# Altium schematic sheet NIXIEClock_SCH.SchDoc
size A2
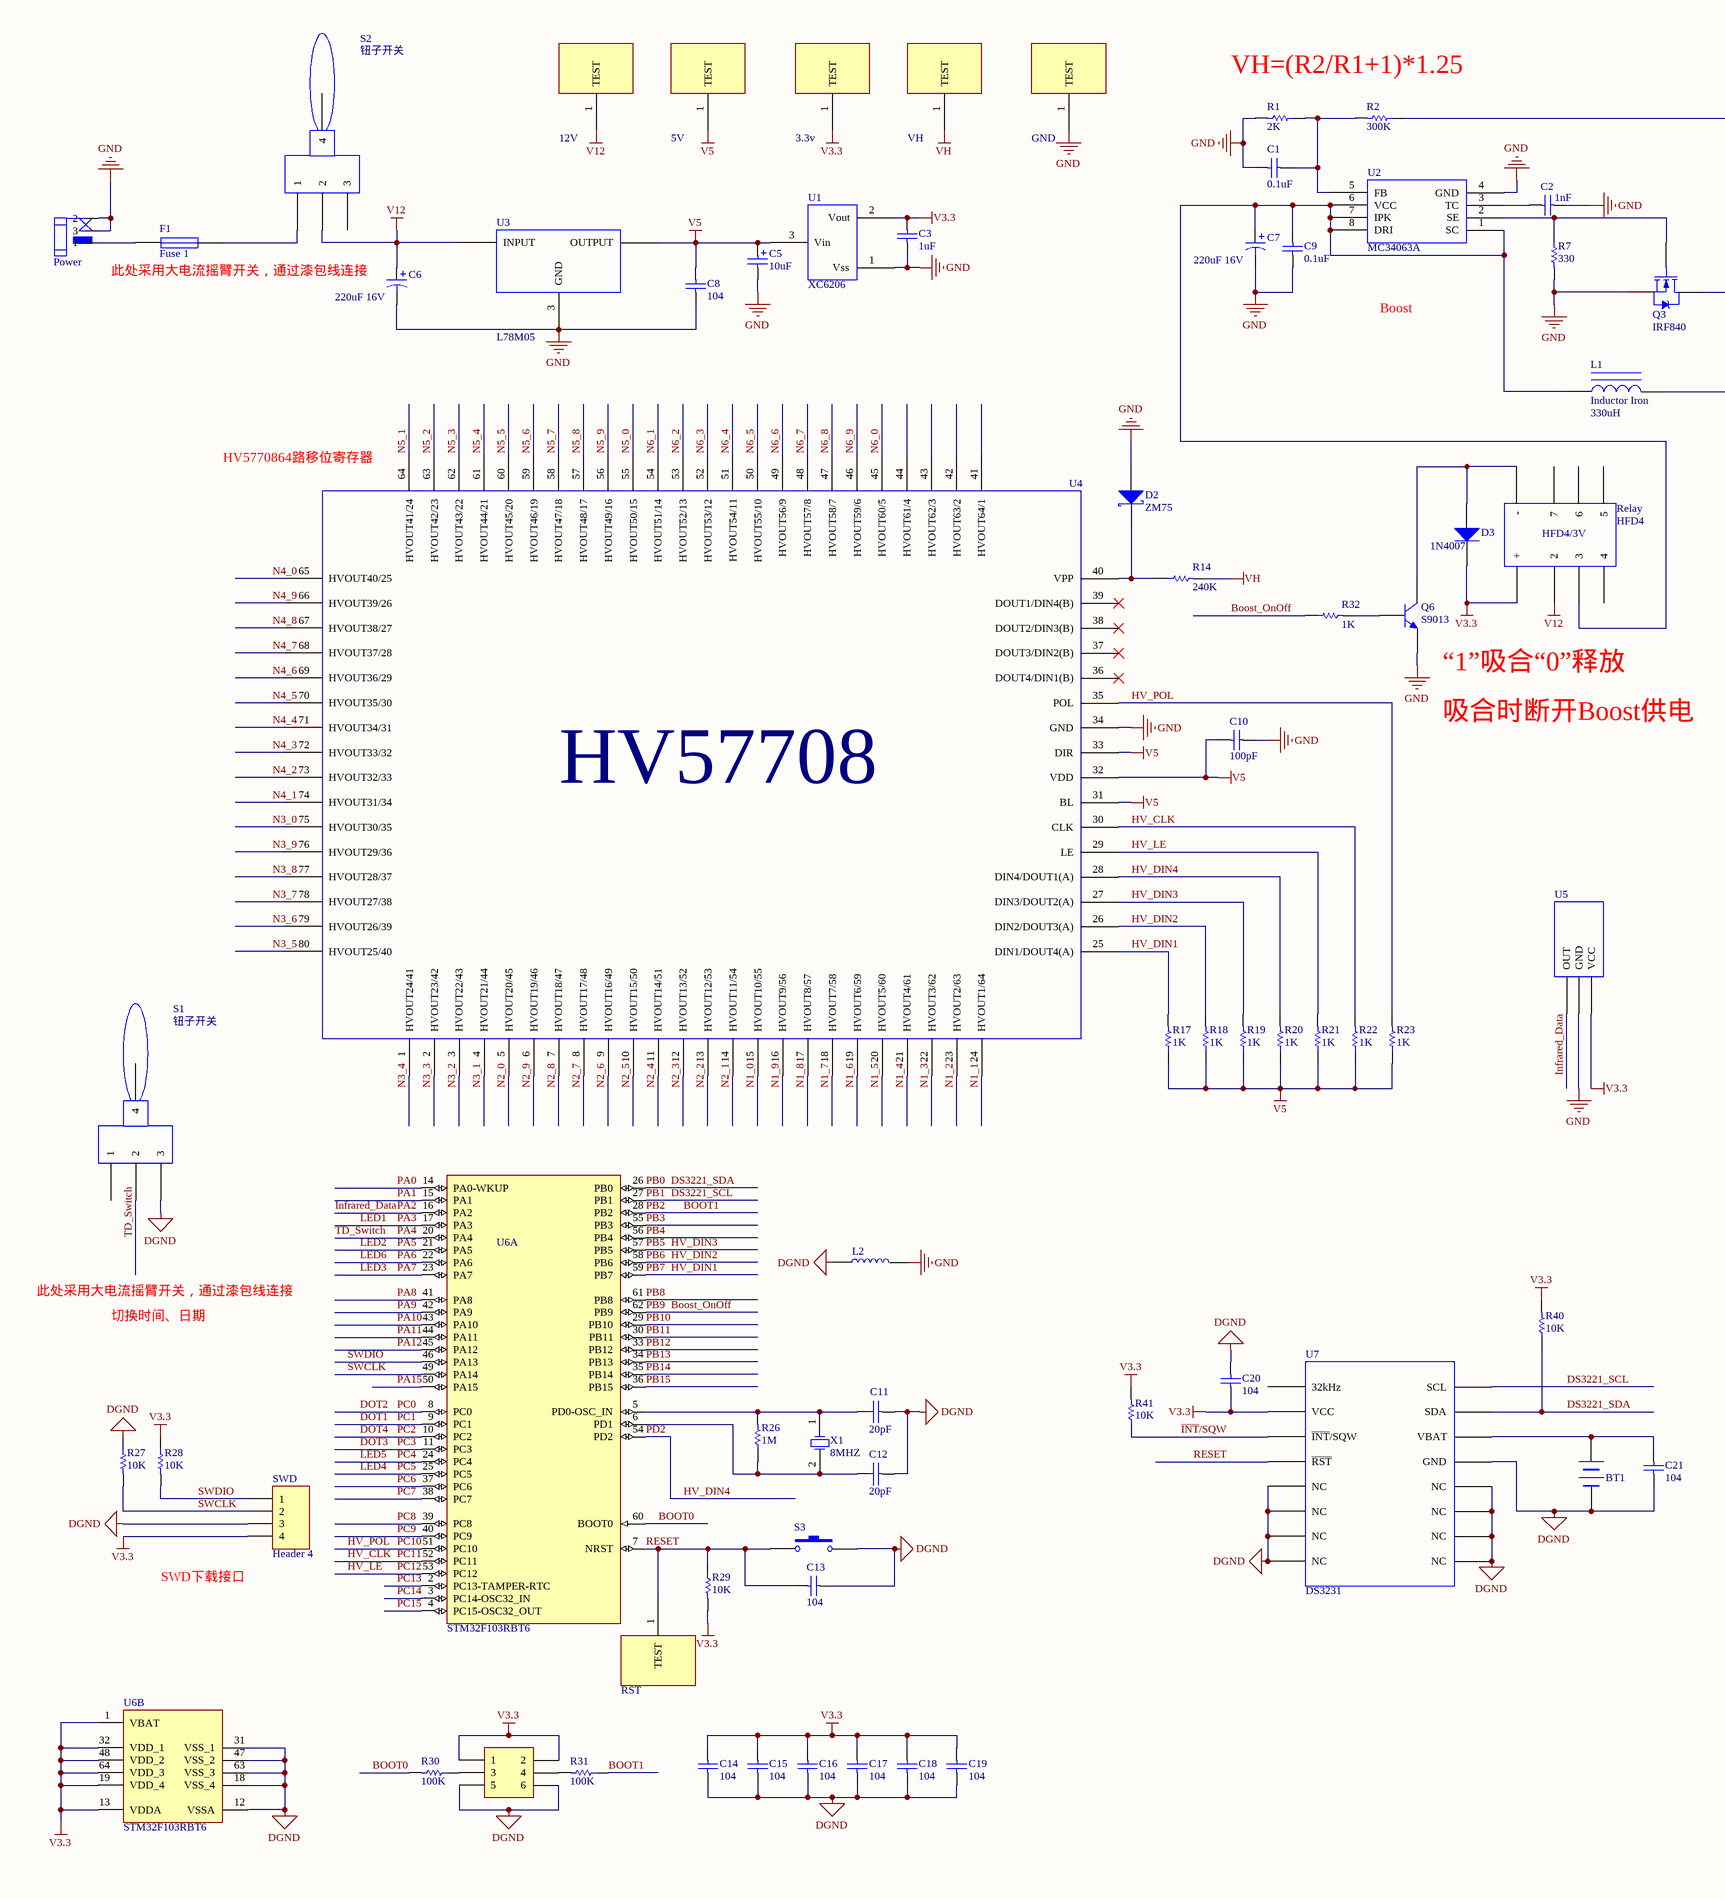
[diagram p0: NIXIEClock_SCH.SchDoc, left]
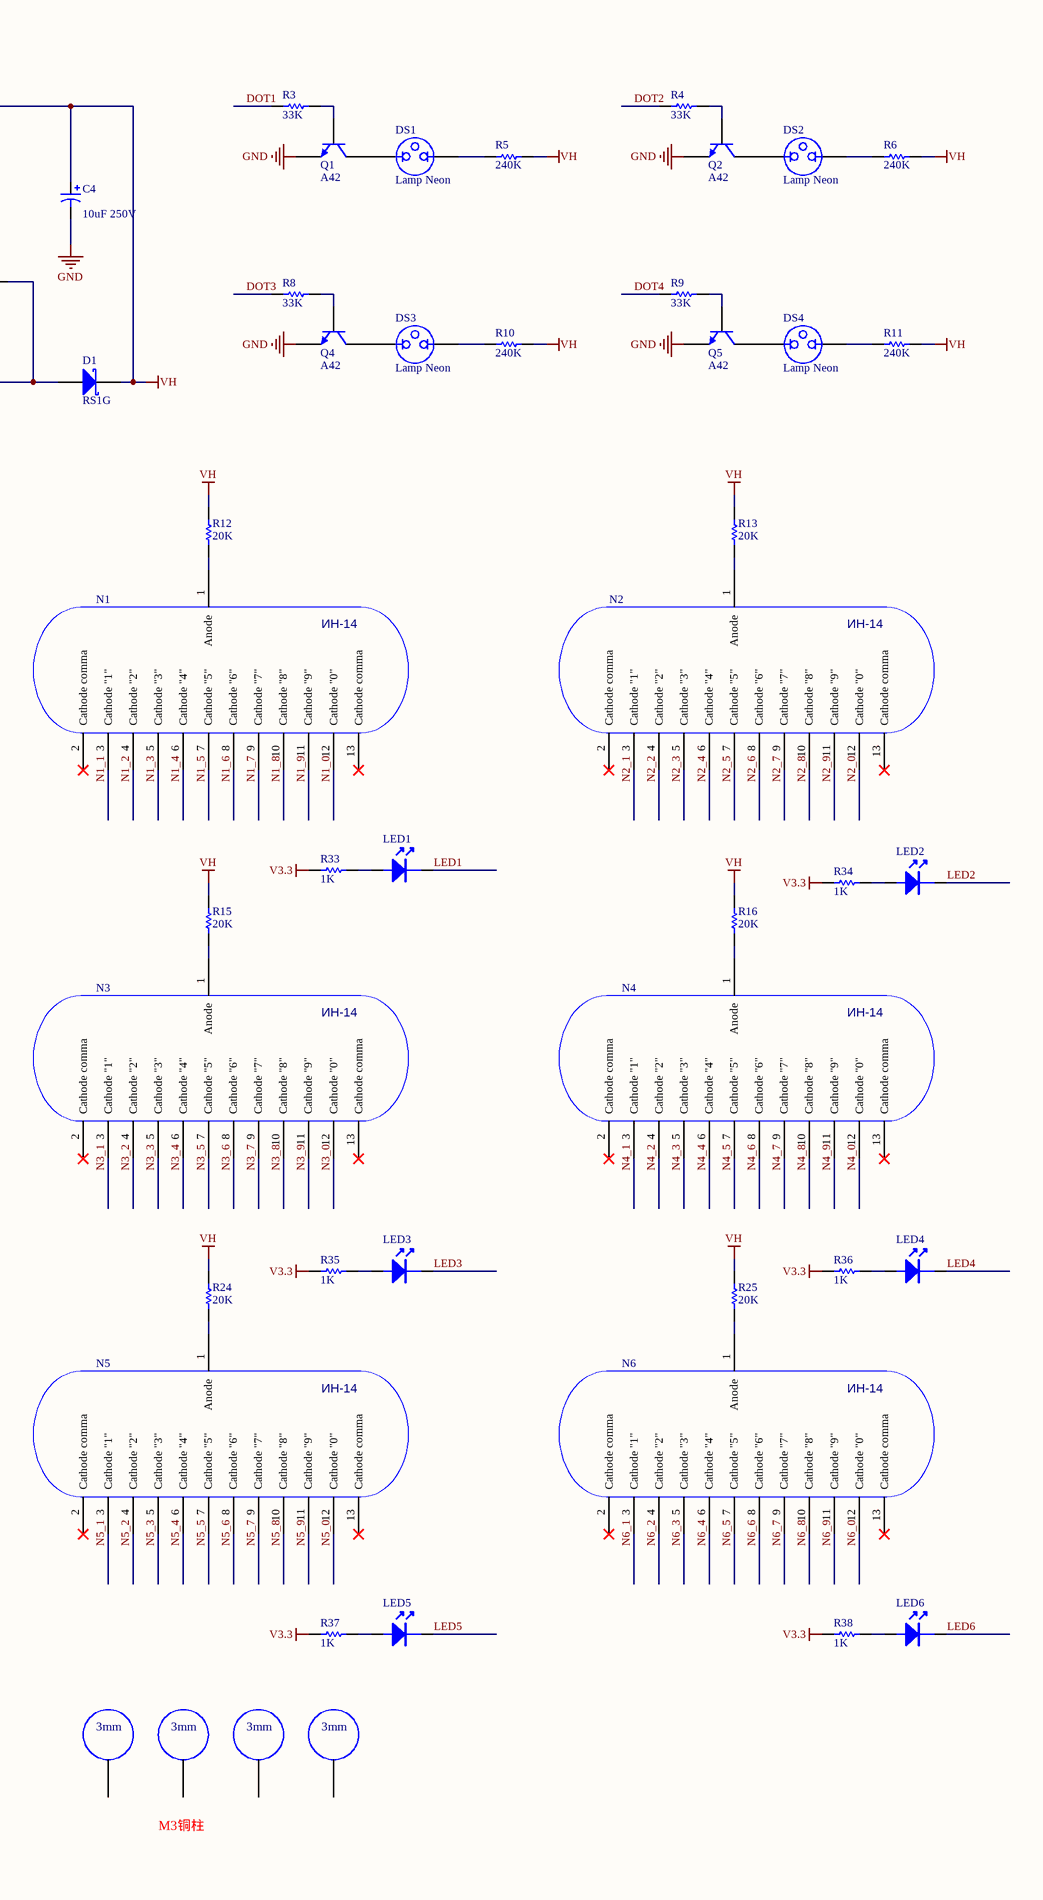
[diagram p1: NIXIEClock_SCH.SchDoc, right]

## Parts
3.3v  TEST  [TEST]  (value not drawn)
5V  TEST  [TEST]  (value not drawn)
12V  TEST  [TEST]  (value not drawn)
BOOT  Header 3X2  [HDR2X3]  (value not drawn)
BT1  CR1220 holder  [BAT1220]  (value not drawn)
C1  value 0.1uF  [C0603]  (hidden comment: Cap Semi)
C2  value 1nF  [C0603]  (hidden comment: Cap Semi)
C3  value 1uF  [C0603]  (hidden comment: Cap Semi)
C4  value 10uF 250V  [电容卧放2.54mm-1]  (hidden comment: Cap Pol1)
C5  value 10uF  [C1206]  (hidden comment: Cap Pol1)
C6  value 220uF 16V  [HONOR_63X77]  (hidden comment: Cap Pol1)
C7  value 220uF 16V  [HONOR_63X77]  (hidden comment: Cap Pol1)
C8  value 104  [C0603]  (hidden comment: Cap Semi)
C9  value 0.1uF  [C0603]  (hidden comment: Cap Semi)
C10  value 100pF  [C0603]  (hidden comment: Cap)
C11  20pF  [C0603]
C12  20pF  [C0603]
C13  value 104  [C0603]  (hidden comment: Cap Semi)
C14  value 104  [C0603]  (hidden comment: Cap Semi)
C15  value 104  [C0603]  (hidden comment: Cap Semi)
C16  value 104  [C0603]  (hidden comment: Cap Semi)
C17  value 104  [C0603]  (hidden comment: Cap Semi)
C18  value 104  [C0603]  (hidden comment: Cap Semi)
C19  value 104  [C0603]  (hidden comment: Cap Semi)
C20  value 104  [C0603]  (hidden comment: Cap Semi)
C21  value 104  [C0603]  (hidden comment: Cap Semi)
D1  RS1G  [SMB]
D2  ZM75  [LL-34]
D3  1N4007  [1N4007W]
DC1  Power  [DC-5mm贴片]
DS1  Lamp Neon  [PIN2]
DS2  Lamp Neon  [PIN2]
DS3  Lamp Neon  [PIN2]
DS4  Lamp Neon  [PIN2]
F1  Fuse 1  [SMD2018P100TF]
GND  TEST  [TEST]  (value not drawn)
L1  Inductor Iron  value 330uH  [GDRH127]
L2  L0  [0805]  (value not drawn)
LED1  LED  [AVX_B_3528-21]  (value not drawn)
LED2  LED  [AVX_B_3528-21]  (value not drawn)
LED3  LED  [AVX_B_3528-21]  (value not drawn)
LED4  LED  [AVX_B_3528-21]  (value not drawn)
LED5  LED  [AVX_B_3528-21]  (value not drawn)
LED6  LED  [AVX_B_3528-21]  (value not drawn)
N1  ИН-14  [IN14]  (value not drawn)
N2  ИН-14  [IN14]  (value not drawn)
N3  ИН-14  [IN14]  (value not drawn)
N4  ИН-14  [IN14]  (value not drawn)
N5  ИН-14  [IN14]  (value not drawn)
N6  ИН-14  [IN14]  (value not drawn)
Q1  A42  [SOT-23-3L]
Q2  A42  [SOT-23-3L]
Q3  IRF840  [TO-263-2L]
Q4  A42  [SOT-23-3L]
Q5  A42  [SOT-23-3L]
Q6  S9013  [SOT-323]
R1  value 2K  [R0603]  (hidden comment: Res Semi)
R2  value 300K  [R0603]  (hidden comment: Res Semi)
R3  value 33K  [R0603]  (hidden comment: Res Semi)
R4  value 33K  [R0603]  (hidden comment: Res Semi)
R5  value 240K  [R0603]  (hidden comment: Res Semi)
R6  value 240K  [R0603]  (hidden comment: Res Semi)
R7  value 330  [R0603]  (hidden comment: Res Semi)
R8  value 33K  [R0603]  (hidden comment: Res Semi)
R9  value 33K  [R0603]  (hidden comment: Res Semi)
R10  value 240K  [R0603]  (hidden comment: Res Semi)
R11  value 240K  [R0603]  (hidden comment: Res Semi)
R12  value 20K  [R0603]  (hidden comment: Res Semi)
R13  value 20K  [R0603]  (hidden comment: Res Semi)
R14  value 240K  [R0603]  (hidden comment: Res Semi)
R15  value 20K  [R0603]  (hidden comment: Res Semi)
R16  value 20K  [R0603]  (hidden comment: Res Semi)
R17  value 1K  [R0603]  (hidden comment: Res Semi)
R18  value 1K  [R0603]  (hidden comment: Res Semi)
R19  value 1K  [R0603]  (hidden comment: Res Semi)
R20  value 1K  [R0603]  (hidden comment: Res Semi)
R21  value 1K  [R0603]  (hidden comment: Res Semi)
R22  value 1K  [R0603]  (hidden comment: Res Semi)
R23  value 1K  [R0603]  (hidden comment: Res Semi)
R24  value 20K  [R0603]  (hidden comment: Res Semi)
R25  value 20K  [R0603]  (hidden comment: Res Semi)
R26  value 1M  [R0603]  (hidden comment: Res Semi)
R27  value 10K  [R0603]  (hidden comment: Res Semi)
R28  value 10K  [R0603]  (hidden comment: Res Semi)
R29  value 10K  [R0603]  (hidden comment: Res Semi)
R30  value 100K  [R0603]  (hidden comment: Res Semi)
R31  value 100K  [R0603]  (hidden comment: Res Semi)
R32  value 1K  [R0603]  (hidden comment: Res Semi)
R33  value 1K  [R0603]  (hidden comment: Res Semi)
R34  value 1K  [R0603]  (hidden comment: Res Semi)
R35  value 1K  [R0603]  (hidden comment: Res Semi)
R36  value 1K  [R0603]  (hidden comment: Res Semi)
R37  value 1K  [R0603]  (hidden comment: Res Semi)
R38  value 1K  [R0603]  (hidden comment: Res Semi)
R40  value 10K  [R0603]  (hidden comment: Res Semi)
R41  value 10K  [R0603]  (hidden comment: Res Semi)
Relay  HFD4  [HFD4]
RST  TEST  [TEST]  (value not drawn)
S1  钮子开关  [钮子开关6mm]
S2  钮子开关  [钮子开关6mm]
S3  SW-PB  [贴片按键（红头）]  (value not drawn)
SWD  Header 4  [HDR1X4]
T1  铜柱  [螺丝孔-3mm]  (value not drawn)
T2  铜柱  [螺丝孔-3mm]  (value not drawn)
T3  铜柱  [螺丝孔-3mm]  (value not drawn)
T4  铜柱  [螺丝孔-3mm]  (value not drawn)
U1  XC6206  [SOT-23-3L]
U2  MC34063A  [SOIC8]
U3  L78M05  [TO-252-2L]
U4  HV57708  [HV57708PG]  (value not drawn)
U5  Infrared receiver  [SIP3]  (value not drawn)
U6  STM32F103RBT6  [LQFP64_N]  (parts A,B of 2)
U7  DS3231  [SOP16_75MM]
VH  TEST  [TEST]  (value not drawn)
X1  8MHZ  [SMD2_50X32]

## Nets
DGND: BOOT.5 BOOT.6 BT1.2(-) C11.1 C12.1 C13.2 C14.1 C15.1 C16.1 C17.1 C18.1 C19.1 C20.2 C21.1 L2.1 R27.1 S1.3 S3.2 SWD.3 U6.12(VSSA) U6.18(VSS_4) U6.31(VSS_1) U6.47(VSS_2) U6.63(VSS_3) U7.5(NC) U7.6(NC) U7.7(NC) U7.8(NC) U7.9(NC) U7.10(NC) U7.11(NC) U7.12(NC) U7.13(GND)
GND: C1.2 C2.1 C3.1 C4.2 C5.2 C6.2 C7.2 C8.1 C9.1 C10.1 D2.1(A) DC1.2 DC1.3 GND.1(TEST) L2.2 Q1.2(E) Q2.2(E) Q3.3(S) Q4.2(E) Q5.2(E) Q6.2(E) R1.2 R7.2 U1.1(Vss) U2.4(GND) U3.3(GND) U4.34(GND) U5.2(GND)
V3.3: 3.3v.1(TEST) BOOT.1 BOOT.2 C3.2 C14.2 C15.2 C16.2 C17.2 C18.2 C19.2 C20.1 D3.2(K) R28.1 R29.2 R33.1 R34.1 R35.1 R36.1 R37.1 R38.1 R40.2 R41.2 Relay.1(+) SWD.4 U1.2(Vout) U5.3(VCC) U6.1(VBAT) U6.13(VDDA) U6.19(VDD_4) U6.32(VDD_1) U6.48(VDD_2) U6.64(VDD_3) U7.2(VCC)
V5: 5V.1(TEST) C5.1 C8.2 C10.2 R17.1 R18.1 R19.1 R20.1 R21.1 R22.1 R23.1 U1.3(Vin) U3.2(OUTPUT) U4.31(BL) U4.32(VDD) U4.33(DIR)
V12: 12V.1(TEST) C6.1 Relay.2 S2.2 U3.1(INPUT)
VH: C4.1 D1.2(K) R2.1 R5.2 R6.2 R10.2 R11.2 R12.2 R13.2 R14.2 R15.2 R16.2 R24.2 R25.2 VH.1(TEST)
~{INT}/SQW: R41.1 U7.3(~{INT}/SQW)
Boost_OnOff: R32.1 U6.62(PB9)  [also labelled PB9]
BOOT0: R30.2 U6.60(BOOT0)
BOOT1: R31.1 U6.28(PB2)  [also labelled PB2]
DOT1: R3.2 U6.9(PC1)  [also labelled PC1]
DOT2: R4.2 U6.8(PC0)  [also labelled PC0]
DOT3: R8.2 U6.11(PC3)  [also labelled PC3]
DOT4: R9.2 U6.10(PC2)  [also labelled PC2]
DS3221_SCL: U6.27(PB1) U7.16(SCL)  [also labelled PB1]
DS3221_SDA: R40.1 U6.26(PB0) U7.15(SDA)  [also labelled PB0]
HV_CLK: R22.2 U4.30(CLK) U6.52(PC11)  [also labelled PC11]
HV_DIN1: R17.2 U4.25(DIN1/DOUT4(A)) U6.59(PB7)  [also labelled PB7]
HV_DIN2: R18.2 U4.26(DIN2/DOUT3(A)) U6.58(PB6)  [also labelled PB6]
HV_DIN3: R19.2 U4.27(DIN3/DOUT2(A)) U6.57(PB5)  [also labelled PB5]
HV_DIN4: R20.2 U4.28(DIN4/DOUT1(A)) U6.54(PD2)  [also labelled PD2]
HV_LE: R21.2 U4.29(LE) U6.53(PC12)  [also labelled PC12]
HV_POL: R23.2 U4.35(POL) U6.51(PC10)  [also labelled PC10]
Infrared_Data: U5.1(OUT) U6.16(PA2)  [also labelled PA2]
LED1: LED1.2 U6.17(PA3)  [also labelled PA3]
LED2: LED2.2 U6.21(PA5)  [also labelled PA5]
LED3: LED3.2 U6.23(PA7)  [also labelled PA7]
LED4: LED4.2 U6.25(PC5)  [also labelled PC5]
LED5: LED5.2 U6.24(PC4)  [also labelled PC4]
LED6: LED6.2 U6.22(PA6)  [also labelled PA6]
N1_0: N1.12(Cathode_"0") U4.15(HVOUT10/55)
N1_1: N1.3(Cathode_"1") U4.24(HVOUT1/64)
N1_2: N1.4(Cathode_"2") U4.23(HVOUT2/63)
N1_3: N1.5(Cathode_"3") U4.22(HVOUT3/62)
N1_4: N1.6(Cathode_"4") U4.21(HVOUT4/61)
N1_5: N1.7(Cathode_"5") U4.20(HVOUT5/60)
N1_6: N1.8(Cathode_"6") U4.19(HVOUT6/59)
N1_7: N1.9(Cathode_"7") U4.18(HVOUT7/58)
N1_8: N1.10(Cathode_"8") U4.17(HVOUT8/57)
N1_9: N1.11(Cathode_"9") U4.16(HVOUT9/56)
N2_0: N2.12(Cathode_"0") U4.5(HVOUT20/45)
N2_1: N2.3(Cathode_"1") U4.14(HVOUT11/54)
N2_2: N2.4(Cathode_"2") U4.13(HVOUT12/53)
N2_3: N2.5(Cathode_"3") U4.12(HVOUT13/52)
N2_4: N2.6(Cathode_"4") U4.11(HVOUT14/51)
N2_5: N2.7(Cathode_"5") U4.10(HVOUT15/50)
N2_6: N2.8(Cathode_"6") U4.9(HVOUT16/49)
N2_7: N2.9(Cathode_"7") U4.8(HVOUT17/48)
N2_8: N2.10(Cathode_"8") U4.7(HVOUT18/47)
N2_9: N2.11(Cathode_"9") U4.6(HVOUT19/46)
N3_0: N3.12(Cathode_"0") U4.75(HVOUT30/35)
N3_1: N3.3(Cathode_"1") U4.4(HVOUT21/44)
N3_2: N3.4(Cathode_"2") U4.3(HVOUT22/43)
N3_3: N3.5(Cathode_"3") U4.2(HVOUT23/42)
N3_4: N3.6(Cathode_"4") U4.1(HVOUT24/41)
N3_5: N3.7(Cathode_"5") U4.80(HVOUT25/40)
N3_6: N3.8(Cathode_"6") U4.79(HVOUT26/39)
N3_7: N3.9(Cathode_"7") U4.78(HVOUT27/38)
N3_8: N3.10(Cathode_"8") U4.77(HVOUT28/37)
N3_9: N3.11(Cathode_"9") U4.76(HVOUT29/36)
N4_0: N4.12(Cathode_"0") U4.65(HVOUT40/25)
N4_1: N4.3(Cathode_"1") U4.74(HVOUT31/34)
N4_2: N4.4(Cathode_"2") U4.73(HVOUT32/33)
N4_3: N4.5(Cathode_"3") U4.72(HVOUT33/32)
N4_4: N4.6(Cathode_"4") U4.71(HVOUT34/31)
N4_5: N4.7(Cathode_"5") U4.70(HVOUT35/30)
N4_6: N4.8(Cathode_"6") U4.69(HVOUT36/29)
N4_7: N4.9(Cathode_"7") U4.68(HVOUT37/28)
N4_8: N4.10(Cathode_"8") U4.67(HVOUT38/27)
N4_9: N4.11(Cathode_"9") U4.66(HVOUT39/26)
N5_0: N5.12(Cathode_"0") U4.55(HVOUT50/15)
N5_1: N5.3(Cathode_"1") U4.64(HVOUT41/24)
N5_2: N5.4(Cathode_"2") U4.63(HVOUT42/23)
N5_3: N5.5(Cathode_"3") U4.62(HVOUT43/22)
N5_4: N5.6(Cathode_"4") U4.61(HVOUT44/21)
N5_5: N5.7(Cathode_"5") U4.60(HVOUT45/20)
N5_6: N5.8(Cathode_"6") U4.59(HVOUT46/19)
N5_7: N5.9(Cathode_"7") U4.58(HVOUT47/18)
N5_8: N5.10(Cathode_"8") U4.57(HVOUT48/17)
N5_9: N5.11(Cathode_"9") U4.56(HVOUT49/16)
N6_0: N6.12(Cathode_"0") U4.45(HVOUT60/5)
N6_1: N6.3(Cathode_"1") U4.54(HVOUT51/14)
N6_2: N6.4(Cathode_"2") U4.53(HVOUT52/13)
N6_3: N6.5(Cathode_"3") U4.52(HVOUT53/12)
N6_4: N6.6(Cathode_"4") U4.51(HVOUT54/11)
N6_5: N6.7(Cathode_"5") U4.50(HVOUT55/10)
N6_6: N6.8(Cathode_"6") U4.49(HVOUT56/9)
N6_7: N6.9(Cathode_"7") U4.48(HVOUT57/8)
N6_8: N6.10(Cathode_"8") U4.47(HVOUT58/7)
N6_9: N6.11(Cathode_"9") U4.46(HVOUT59/6)
PA0: U6.14(PA0-WKUP)
PA1: U6.15(PA1)
PA4: S1.2 U6.20(PA4)  [also labelled TD_Switch]
PA8: U6.41(PA8)
PA9: U6.42(PA9)
PA10: U6.43(PA10)
PA11: U6.44(PA11)
PA12: U6.45(PA12)
PA15: U6.50(PA15)
PB3: U6.55(PB3)
PB4: U6.56(PB4)
PB8: U6.61(PB8)
PB10: U6.29(PB10)
PB11: U6.30(PB11)
PB12: U6.33(PB12)
PB13: U6.34(PB13)
PB14: U6.35(PB14)
PB15: U6.36(PB15)
PC6: U6.37(PC6)
PC7: U6.38(PC7)
PC8: U6.39(PC8)
PC9: U6.40(PC9)
PC13: U6.2(PC13-TAMPER-RTC)
PC14: U6.3(PC14-OSC32_IN)
PC15: U6.4(PC15-OSC32_OUT)
RESET: C13.1 R29.1 RST.1(TEST) S3.1 U6.7(NRST) U7.4(~{RST})
SWCLK: R27.2 SWD.2 U6.49(PA14)
SWDIO: R28.2 SWD.1 U6.46(PA13)
NetBOOT_3: BOOT.3 R30.1
NetBOOT_4: BOOT.4 R31.2
NetBT1_1: BT1.1(+) C21.2 U7.14(VBAT)
NetC1_1: C1.1 R1.1 R2.2 U2.5(FB)
NetC2_2: C2.2 U2.3(TC)
NetC7_1: C7.1 C9.2 L1.1 Relay.3 U2.1(SC) U2.6(VCC) U2.7(IPK) U2.8(DRI)
NetC11_2: C11.2 R26.2 U6.5(PD0-OSC_IN) X1.1(OSC1)
NetC12_2: C12.2 R26.1 U6.6(PD1) X1.2(OSC2)
NetD1_1: D1.1(A) L1.2 Q3.2(D)
NetD2_2: D2.2(K) R14.1 U4.40(VPP)
NetD3_1: D3.1(A) Q6.3(C) Relay.8(-)
NetDC1_1: DC1.1 F1.1
NetDS1_1: DS1.1 Q1.3(C)
NetDS1_2: DS1.2 R5.1
NetDS2_1: DS2.1 Q2.3(C)
NetDS2_2: DS2.2 R6.1
NetDS3_1: DS3.1 Q4.3(C)
NetDS3_2: DS3.2 R10.1
NetDS4_1: DS4.1 Q5.3(C)
NetDS4_2: DS4.2 R11.1
NetF1_2: F1.2 S2.1
NetLED1_1: LED1.1 R33.2
NetLED2_1: LED2.1 R34.2
NetLED3_1: LED3.1 R35.2
NetLED4_1: LED4.1 R36.2
NetLED5_1: LED5.1 R37.2
NetLED6_1: LED6.1 R38.2
NetN1_1: N1.1(Anode) R12.1
NetN2_1: N2.1(Anode) R13.1
NetN3_1: N3.1(Anode) R15.1
NetN4_1: N4.1(Anode) R16.1
NetN5_1: N5.1(Anode) R24.1
NetN6_1: N6.1(Anode) R25.1
NetQ1_1: Q1.1(B) R3.1
NetQ2_1: Q2.1(B) R4.1
NetQ3_1: Q3.1(G) R7.1 U2.2(SE)
NetQ4_1: Q4.1(B) R8.1
NetQ5_1: Q5.1(B) R9.1
NetQ6_1: Q6.1(B) R32.2

Not connected (* = marked no-connect by the designer): N1 2(Cathode_comma)* 13(Cathode_comma)*; N2 2(Cathode_comma)* 13(Cathode_comma)*; N3 2(Cathode_comma)* 13(Cathode_comma)*; N4 2(Cathode_comma)* 13(Cathode_comma)*; N5 2(Cathode_comma)* 13(Cathode_comma)*; N6 2(Cathode_comma)* 13(Cathode_comma)*; Relay 4 5 6 7; S1 1 4; S2 3 4; T1 1; T2 1; T3 1; T4 1; U4 36(DOUT4/DIN1(B))* 37(DOUT3/DIN2(B))* 38(DOUT2/DIN3(B))* 39(DOUT1/DIN4(B))* 41(HVOUT64/1) 42(HVOUT63/2) 43(HVOUT62/3) 44(HVOUT61/4); U7 1(32kHz)

## Notes on the sheet
- VH=(R2/R1+1)*1.25
- 此处采用大电流摇臂开关，通过漆包线连接
- Boost
- (near U4) HV5770864路移位寄存器
- (near Q6) “1”吸合“0”释放
- 吸合时断开Boost供电
- 切换时间、日期
- SWD下载接口
- M3铜柱
- (in symbol Relay) HFD4/3V
- (in symbol 铜柱) 3mm

## Library data of the parts
BOOT = Header 3X2: Header, 3-Pin, Dual row; LatestRevisionDate: 17-Jul-2002; LatestRevisionNote: Re-released for DXP Platform.; Publisher: Altium Limited
BT1 = BATTERY
C1-C3 C8 C9 C13-C21 = Cap Semi: Capacitor (Semiconductor SIM Model); Published: 8-Jun-2000; LatestRevisionDate: 17-Jul-2002; LatestRevisionNote: Re-released for DXP Platform.; PackageReference: C1206; Publisher: Altium Limited
C4-C7 = Cap Pol1: Polarized Capacitor (Radial); Published: 8-Jun-2000; LatestRevisionDate: 17-Jul-2002; LatestRevisionNote: Re-released for DXP Platform.; PackageReference: RB7.6-15; Publisher: Altium Limited
  C4 C6 C7: PackageDescription: Polarized Capacitor (Radial); 2 Leads
C10 = Cap: Capacitor; Published: 8-Jun-2000; LatestRevisionDate: 17-Jul-2002; LatestRevisionNote: Re-released for DXP Platform.; PackageReference: RAD-0.3; Publisher: Altium Limited; PackageDescription: Radial Cap, Thru-Hole; 2 Leads; 0.3 in Pin Spacing
C11 C12 = 普通电容: Capacitor
D1 = D Schottky: Schottky Diode; Published: 8-Jun-2000; LatestRevisionDate: 17-Jul-2002; LatestRevisionNote: Re-released for DXP Platform.; PackageReference: SMB; Publisher: Altium Limited; PackageDescription: DO-214-AA/SMB; 2 C-Bend Leads; Body 5.3 x 3.6 mm, inc. leads (LxW); Code_JEDEC: DO-214-AA
D2 = Diode 11DQ03: Schottky Rectifier; Published: 8-Jun-2000; LatestRevisionDate: 17-Jul-2002; LatestRevisionNote: Re-released for DXP Platform.; DatasheetVersion: Dec-1997; PackageReference: DO-204AL; Publisher: Altium Limited; PackageDescription: Diode, Axial; Body 5.2 x 2.7 mm (LxDia. max), Lead Dia. 0.86 mm (max); Code_JEDEC: DO-204-AL; ComponentLink1Description: Manufacturer Link; ComponentLink1URL: http://www.irf.com/; ComponentLink2Description: Datasheet; ComponentLink2URL: http://www.irf.com/product-info/datasheets/data/11dq03.pdf
D3 = Diode 1N4007: 1 Amp General Purpose Rectifier; Published: 8-Jun-2000; LatestRevisionDate: 17-Jul-2002; LatestRevisionNote: Re-released for DXP Platform.; DatasheetVersion: 1998; PackageVersion: Aug-1999; PackageReference: DO-41; Publisher: Altium Limited; PackageDescription: Diode, Axial; Body 5.2 x 2.7 mm (LxDia. max), Lead Dia. 0.86 mm (max); Code_JEDEC: DO-204-AL; ComponentLink1Description: Manufacturer Link; ComponentLink1URL: http://www.fairchildsemi.com/; ComponentLink2Description: Datasheet; ComponentLink2URL: http://www.fairchildsemi.com/ds/1N%2F1N4001.pdf
DC1 = 电源插座5.4mm
DS1-DS4 = Lamp Neon: Neon Lamp; Published: 24-Mar-1999; LatestRevisionDate: 17-Jul-2002; LatestRevisionNote: Re-released for DXP Platform.; PackageReference: PIN2; Publisher: Altium Limited
F1 = Fuse 1: Fuse; Published: 8-Jun-2000; LatestRevisionDate: 17-Jul-2002; LatestRevisionNote: Re-released for DXP Platform.; PackageReference: PIN-W2/E2.8; Publisher: Altium Limited; PackageDescription: Thru-Hole; 2 Leads
L1 = Inductor Iron: Magnetic-Core Inductor; Published: 24-Mar-1999; LatestRevisionDate: 17-Jul-2002; LatestRevisionNote: Re-released for DXP Platform.; PackageReference: AXIAL-0.9; Publisher: Altium Limited; PackageDescription: Axial Device, Thru-Hole; 2 Leads; 0.9 in Pin Spacing
LED1-LED6 = LED: LED发光管
Q1 Q2 Q4-Q6 = NPN: NPN Bipolar Transistor; Published: 8-Jun-2000; LatestRevisionDate: 17-Jul-2002; LatestRevisionNote: Re-released for DXP Platform.; PackageReference: TO-226; Publisher: Altium Limited; Code_JEDEC: TO-226-AA
Q3 = NMOS-2: N-Channel Power MOSFET; Note: Pin 2 is electrically connected to pin 4.; Published: 8-Jun-2000; LatestRevisionDate: 17-Jul-2002; LatestRevisionNote: Re-released for DXP Platform.; DatasheetVersion: PD-9.814; PackageVersion: Feb-1997; PackageReference: TO-220AB; Publisher: Altium Limited; PackageDescription: TO, Thru-Hole, Vertical, Heatsink Mounted; 3 In-Line Leads; Pitch 2.54 mm; ComponentLink1Description: Manufacturer Link; ComponentLink1URL: http://www.irf.com/
R1-R38 R40 R41 = Res Semi: Semiconductor Resistor; Published: 8-Jun-2000; LatestRevisionDate: 17-Jul-2002; LatestRevisionNote: Re-released for DXP Platform.; PackageReference: AXIAL-0.5; Publisher: Altium Limited
Relay = Relay
S3 = SW-PB: Switch; Published: 24-Mar-1999; LatestRevisionDate: 17-Jul-2002; LatestRevisionNote: Re-released for DXP Platform.; PackageReference: SPST-2; Publisher: Altium Limited
SWD = Header 4: Header, 4-Pin; LatestRevisionDate: 17-Jul-2002; LatestRevisionNote: Re-released for DXP Platform.; Publisher: Altium Limited
U6 = STM32F103RBT6: STM32 ARM-based 32-bit MCU Performance Line with 128 kB Flash, 20 kB Internal RAM, -40 to +85°C Temperature, 64-Pin LQFP, Tray; DatasheetVersion: rev13.0, Apr-2011; PackageVersion: rev13, Apr-2011; PackageReference: LQFP64; PackageDescription: 64-Pin Low-Profile Quad Flat Pack, 10 x 10 mm Body, 0.5 mm Pitch (LQFP64); ComponentLink1Description: Manufacturer URL; ComponentLink1URL: http://www.st.com/; ComponentLink2Description: STM32F103 Datasheet; ComponentLink2URL: http://www.st.com/internet/com/TECHNICAL_RESOURCES/TECHNICAL_LITERATURE/DATASHEET/CD00161566.pdf; ComponentLink3Description: STM32 Family Web Page; ComponentLink3URL: www.st.com/stm32
X1 = XTAL: Crystal Oscillator; Published: 8-Jun-2000; LatestRevisionDate: 17-Jul-2002; LatestRevisionNote: Re-released for DXP Platform.; PackageReference: R38; Publisher: Altium Limited